# EAGLE design logic_board (EAGLE 9.1.3)
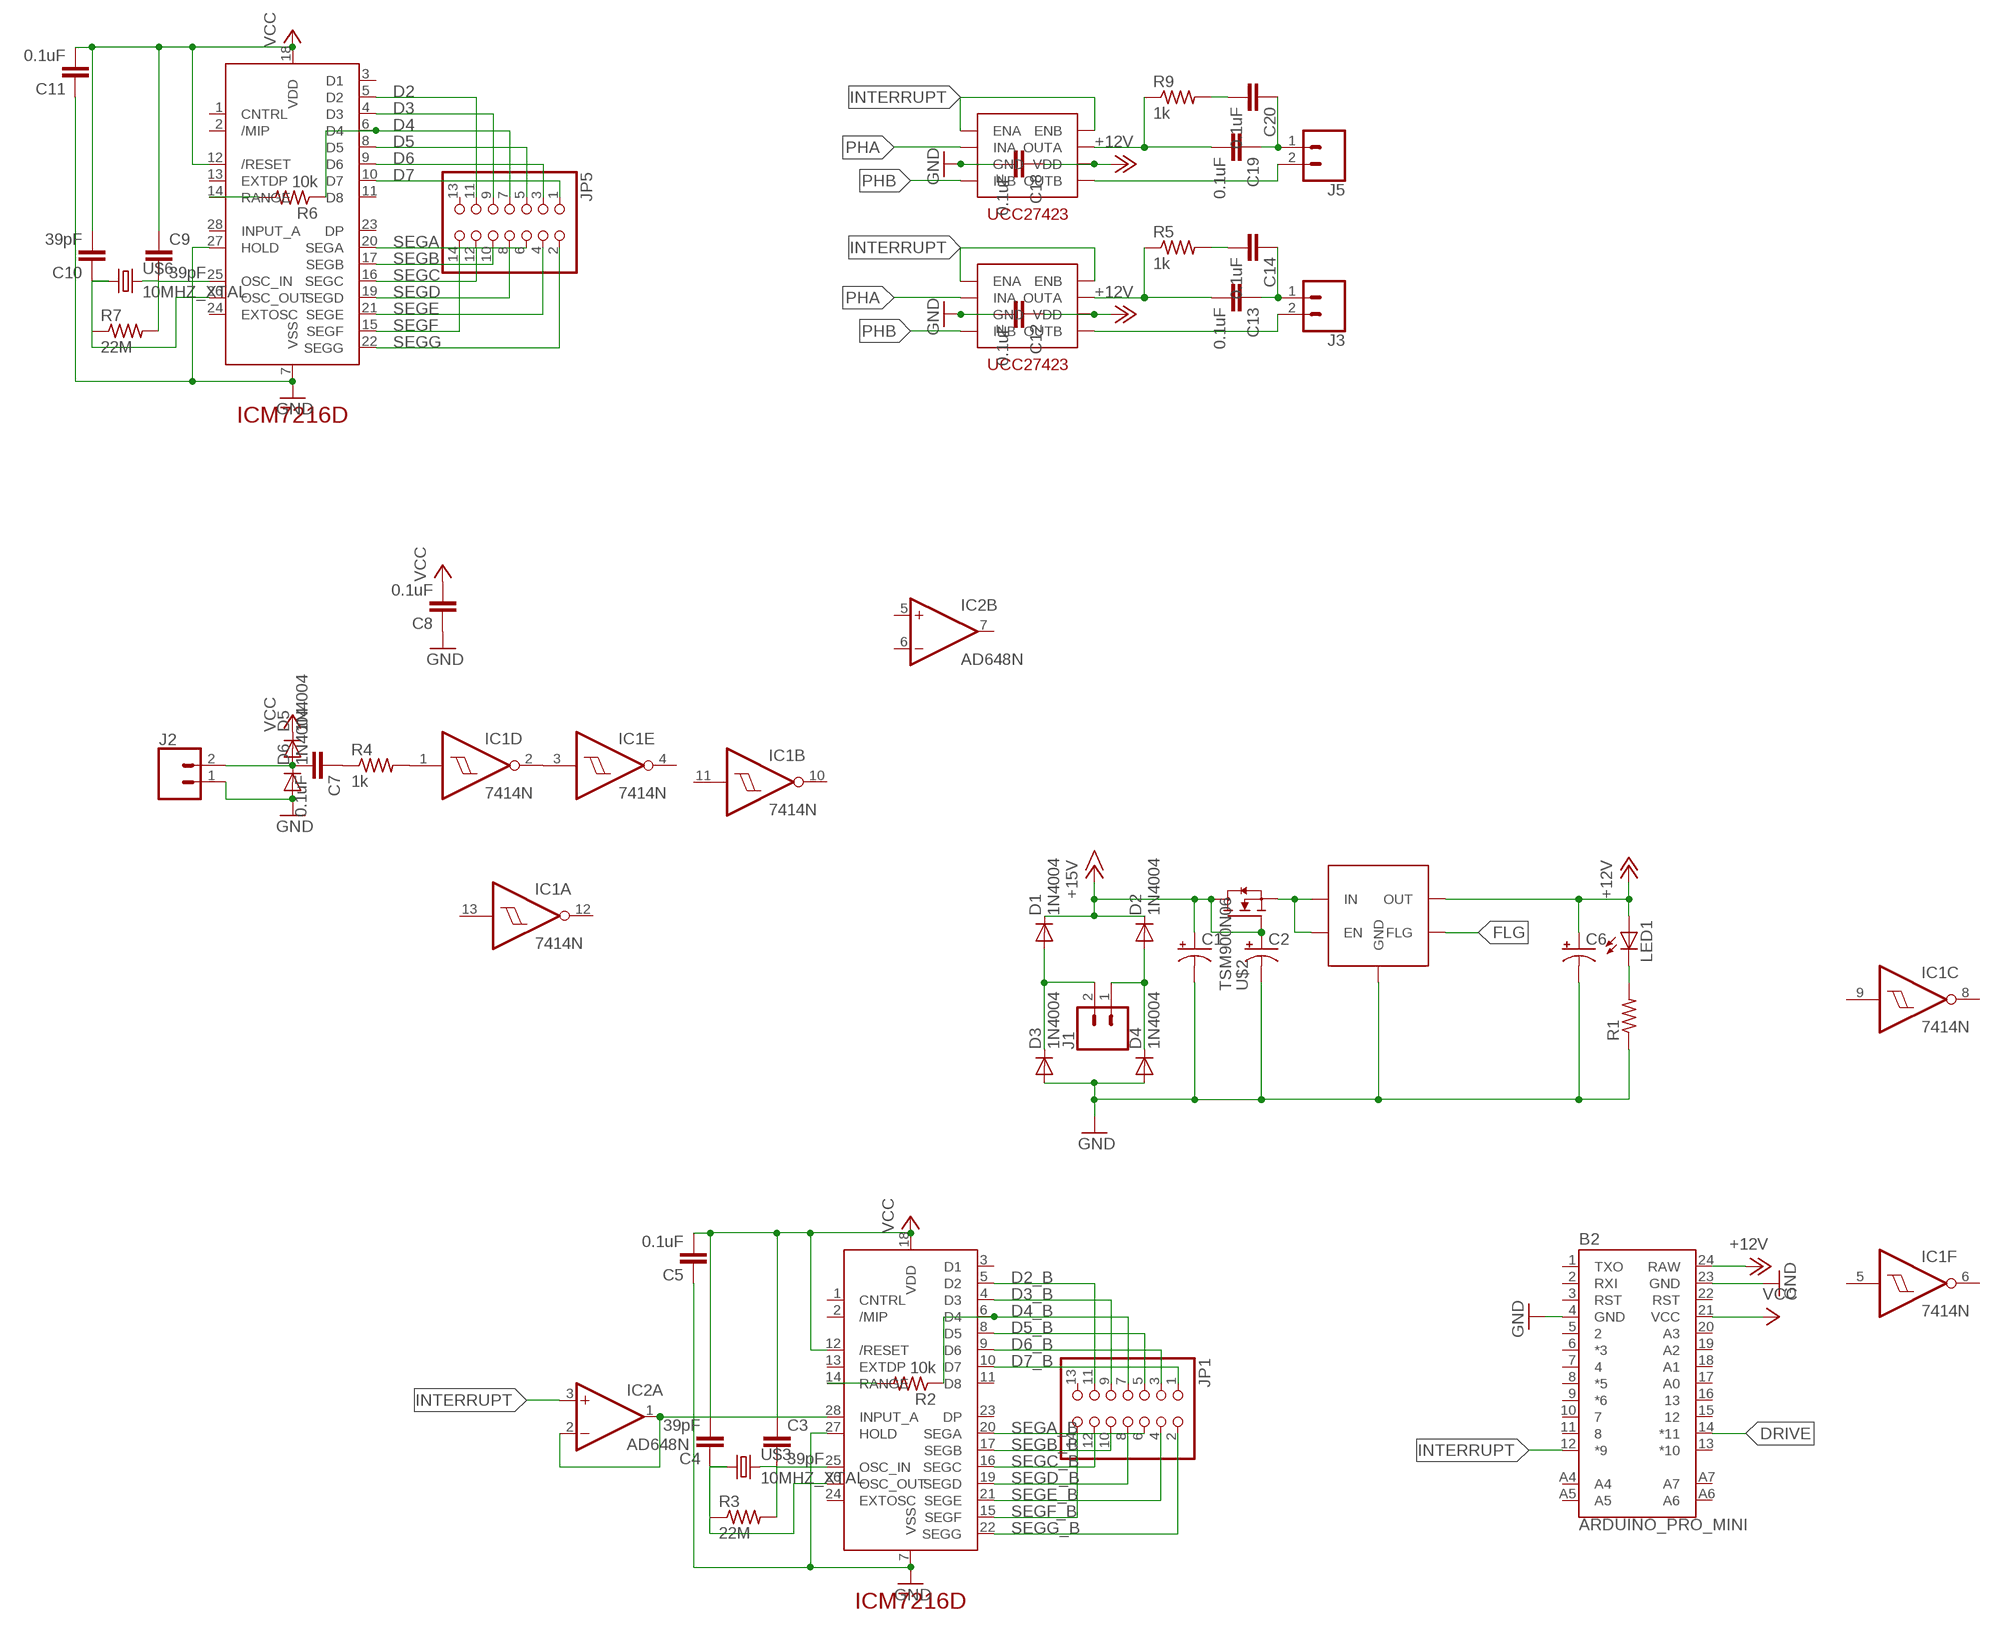
[diagram p0: schematic, sheet 1]

## Parts
B2  ARDUINO_PRO_MINI  [ARDUINO_PRO_MINI]
C1  CPOL-USE7.5-16  [E7,5-16]
C2  CPOL-USE7.5-16  [E7,5-16]
C3  39pF  C-EU050-030X075  [C050-030X075]
C4  39pF  C-EU050-030X075  [C050-030X075]
C5  0.1uF  C-EU050-030X075  [C050-030X075]
C6  CPOL-USE7.5-16  [E7,5-16]
C7  0.1uF  C-EU050-030X075  [C050-030X075]
C8  0.1uF  C-EU050-030X075  [C050-030X075]
C9  39pF  C-EU050-030X075  [C050-030X075]
C10  39pF  C-EU050-030X075  [C050-030X075]
C11  0.1uF  C-EU050-030X075  [C050-030X075]
C12  0.1uF  C-EU050-030X075  [C050-030X075]
C13  0.1uF  C-EU050-030X075  [C050-030X075]
C14  0.1uF  C-EU050-030X075  [C050-030X075]
C18  0.1uF  C-EU050-030X075  [C050-030X075]
C19  0.1uF  C-EU050-030X075  [C050-030X075]
C20  0.1uF  C-EU050-030X075  [C050-030X075]
D1  1N4004  [DO41-10]
D2  1N4004  [DO41-10]
D3  1N4004  [DO41-10]
D4  1N4004  [DO41-10]
D5  1N4004  [DO41-10]
D6  1N4004  [DO41-10]
IC1  7414N  [DIL14]
IC2  AD648N  [DIL08]
J1  CONN_025MM  [SCREWTERMINAL-5MM-2]
J2  CONN_025MM  [SCREWTERMINAL-5MM-2]
J3  CONN_025MM  [SCREWTERMINAL-5MM-2]
J5  CONN_025MM  [SCREWTERMINAL-5MM-2]
JP1  PINHD-2X7  [2X07]
JP5  PINHD-2X7  [2X07]
LED1  LED5MM  [LED5MM]
R1  R-US_0204/7  [0204/7]
R2  10k  R-US_0204/7  [0204/7]
R3  22M  R-US_0204/7  [0204/7]
R4  1k  R-US_0204/7  [0204/7]
R5  1k  R-US_0204/7  [0204/7]
R6  10k  R-US_0204/7  [0204/7]
R7  22M  R-US_0204/7  [0204/7]
R9  1k  R-US_0204/7  [0204/7]
U$1  ICM7216D  [DIP1524W55P254L3740H635Q28B]
U$2  TSM900N06  [TO-251S]
U$3  10MHZ_XTAL  [XTAL]
U$4  MIC29301  [TO-220]
U$5  ICM7216D  [DIP1524W55P254L3740H635Q28B]
U$6  10MHZ_XTAL  [XTAL]
U$7  UCC27423  [DIP762W53P254L959H508Q8B]
U$9  UCC27423  [DIP762W53P254L959H508Q8B]

## Nets
+12V: B2.24(RAW) C6.+ C12.1 C18.1 LED1.A U$4.P$4(OUT) U$7.6(VDD) U$9.6(VDD)
+15V: C1.+ C2.+ D1.C D2.C U$2.P$1(G) U$2.P$2(D)
D2: JP5.11 U$5.5(D2)
D2_B: JP1.11 U$1.5(D2)
D3: JP5.9 U$5.4(D3)
D3_B: JP1.9 U$1.4(D3)
D4: JP5.7 R6.1 U$5.6(D4)
D4_B: JP1.7 R2.1 U$1.6(D4)
D5: JP5.5 U$5.8(D5)
D5_B: JP1.5 U$1.8(D5)
D6: JP5.3 U$5.9(D6)
D6_B: JP1.3 U$1.9(D6)
D7: JP5.1 U$5.10(D7)
D7_B: JP1.1 U$1.10(D7)
DRIVE: B2.14(*11)
FLG: U$4.P$5(FLG)
GND: B2.4(GND) B2.23(GND) C1.- C2.- C5.1 C6.- C8.1 C11.1 C12.2 C18.2 D3.A D4.A D6.A J2.1 R1.1 U$1.7(VSS) U$1.27(HOLD) U$4.P$3(GND) U$5.7(VSS) U$5.27(HOLD) U$7.3(GND) U$9.3(GND)
INTERRUPT: B2.12(*9) IC2.3(A:+IN) U$7.1(ENA) U$7.8(ENB) U$9.1(ENA) U$9.8(ENB)
N$1: D1.A D3.C J1.2
N$2: D2.A D4.C J1.1
N$3: U$2.P$3(S) U$4.P$1(EN) U$4.P$2(IN)
N$5: LED1.K(C) R1.2
N$6: C3.2 R3.2 U$1.25(OSC_IN) U$3.P$2
N$7: C4.1 R3.1 U$1.26(OSC_OUT) U$3.P$1
N$8: C7.2 D5.A D6.C J2.2
N$9: C13.1 C14.1 J3.1
N$10: C7.1 R4.1
N$11: R2.2 U$1.14(RANGE)
N$12: R6.2 U$5.14(RANGE)
N$13: C9.2 R7.2 U$5.25(OSC_IN) U$6.P$2
N$14: C10.1 R7.1 U$5.26(OSC_OUT) U$6.P$1
N$15: IC1.1(D:I) R4.2
N$16: IC1.2(D:O) IC1.3(E:I)
N$17: C14.2 R5.2
N$18: C13.2 R5.1 U$7.7(OUTA)
N$19: J3.2 U$7.5(OUTB)
N$20: IC2.1(A:OUT) IC2.2(A:-IN) U$1.28(INPUT_A)
N$24: C19.1 C20.1 J5.1
N$25: C20.2 R9.2
N$26: C19.2 R9.1 U$9.7(OUTA)
N$27: J5.2 U$9.5(OUTB)
PHA: U$7.2(INA) U$9.2(INA)
PHB: U$7.4(INB) U$9.4(INB)
SEGA: JP5.6 U$5.20(SEGA)
SEGA_B: JP1.6 U$1.20(SEGA)
SEGB: JP5.10 U$5.17(SEGB)
SEGB_B: JP1.10 U$1.17(SEGB)
SEGC: JP5.12 U$5.16(SEGC)
SEGC_B: JP1.12 U$1.16(SEGC)
SEGD: JP5.8 U$5.19(SEGD)
SEGD_B: JP1.8 U$1.19(SEGD)
SEGE: JP5.4 U$5.21(SEGE)
SEGE_B: JP1.4 U$1.21(SEGE)
SEGF: JP5.14 U$5.15(SEGF)
SEGF_B: JP1.14 U$1.15(SEGF)
SEGG: JP5.2 U$5.22(SEGG)
SEGG_B: JP1.2 U$1.22(SEGG)
VCC: B2.21(VCC) C3.1 C4.2 C5.2 C8.2 C9.1 C10.2 C11.2 D5.C U$1.12(/RESET) U$1.18(VDD) U$5.12(/RESET) U$5.18(VDD)
Unconnected: B2.1(TXO) B2.2(RXI) B2.3(RST) B2.5 B2.6(*3) B2.7 B2.8(*5) B2.9(*6) B2.10 B2.11 B2.13(*10) B2.15 B2.16 B2.17(A0) B2.18(A1) B2.19(A2) B2.20(A3) B2.22(RST) B2.A4 B2.A5 B2.A6 B2.A7 IC1.4(E:O) IC1.5(F:I) IC1.6(F:O) IC1.8(C:O) IC1.9(C:I) IC1.10(B:O) IC1.11(B:I) IC1.12(A:O) IC1.13(A:I) IC2.5(B:+IN) IC2.6(B:-IN) IC2.7(B:OUT) JP1.13 JP5.13 U$1.1(CNTRL) U$1.2(/MIP) U$1.3(D1) U$1.11(D8) U$1.13(EXTDP) U$1.23(DP) U$1.24(EXTOSC) U$5.1(CNTRL) U$5.2(/MIP) U$5.3(D1) U$5.11(D8) U$5.13(EXTDP) U$5.23(DP) U$5.24(EXTOSC) U$5.28(INPUT_A)

## Power pins joined to a net without a drawn wire
GND: IC1.7(P:GND)
V+: IC2.8(P:V+)
V-: IC2.4(P:V-)
VCC: IC1.14(P:VCC)

## Library data of the parts
B2 = SparkFun-Boards:ARDUINO_PRO_MINI: SparkFun Pro Mini Pro Mini compatible footprint. Dimensions: 0.7 x 1.3" PCB Thickness: 0.8mm SparkFun Products: 3.3V/8MHz <https://www.sparkfun.com/products/11114> 5V/16MHz <https://www.sparkfun.com/products/11113>
C1 C2 C6 = resistor:CPOL-US: POLARIZED CAPACITOR, American symbol
C3-C5 C7-C14 C18-C20 = resistor:C-EU: CAPACITOR, European symbol
D1-D6 = diode:1N4004: DIODE general purpose rectifier, 1 A
IC1 = 74xx-eu:74*14: Hex schmitt trigger INVERTER
IC2 = linear:AD648: OP AMP
J1-J3 J5 = SparkFun-Connectors:CONN_02: Multi connection point. Often used as Generic Header-pin footprint for 0.1 inch spaced/style header connections On any of the 0.1 inch spaced packages, you can populate with these: Break Away Headers - Straight <https://www.sparkfun.com/products/116> (PRT-00116) Break Away Male Headers - Right Angle <https://www.sparkfun.com/products/553> (PRT-00553) Female Headers <https://www.sparkfun.com/products/115> (PRT-00115) Break Away Headers - Machine Pin <https://www.sparkfun.com/products/117> (PRT-00117) Break Away Female Headers - Swiss Machine Pin <https://www.sparkfun.com/products/743> (PRT-00743) For SCREWTERMINALS and SPRING TERMINALS visit here: Screw Terimnals on SparkFun.com <https://www.sparkfun.com/search/results?term=Screw+Terminals> (5mm/3.5mm/2.54mm spacing) This device is also useful as a general connection point to wire up your design to another part of your project. Our various solder wires solder well into these plated through hole pads. Hook-Up Wire - Assortment (Stranded, 22 AWG) <https://www.sparkfun.com/products/11375> (PRT-11375) Hook-Up Wire - Assortment (Solid Core, 22 AWG) <https://www.sparkfun.com/products/11367> (PRT-11367) View the entire wire category on our website here <https://www.sparkfun.com/categories/141> Special notes: Molex polarized connector foot print use with: PRT-08233 with associated crimp pins and housings. 2.54_SCREWTERM for use with PRT-10571. 3.5mm Screw Terminal footprints for PRT-08084 5mm Screw Terminal footprints for use with PRT-08432; SF_SKU: PRT-08432
JP1 JP5 = pinhead:PINHD-2X7: PIN HEADER
LED1 = led:LED: LED OSRAM: - CHIPLED LG R971, LG N971, LY N971, LG Q971, LY Q971, LO R971, LY R971 LH N974, LH R974 LS Q976, LO Q976, LY Q976 LO Q996 - Hyper CHIPLED LW Q18S LB Q993, LB Q99A, LB R99A - SideLED LS A670, LO A670, LY A670, LG A670, LP A670 LB A673, LV A673, LT A673, LW A673 LH A674 LY A675 LS A676, LA A676, LO A676, LY A676, LW A676 LS A679, LY A679, LG A679 - Hyper Micro SIDELED® LS Y876, LA Y876, LO Y876, LY Y876 LT Y87S - SmartLED LW L88C, LW L88S LB L89C, LB L89S, LG L890 LS L89K, LO L89K, LY L89K LS L896, LA L896, LO L896, LY L896 - TOPLED LS T670, LO T670, LY T670, LG T670, LP T670 LSG T670, LSP T670, LSY T670, LOP T670, LYG T670 LG T671, LOG T671, LSG T671 LB T673, LV T673, LT T673, LW T673 LH T674 LS T676, LA T676, LO T676, LY T676, LB T676, LH T676, LSB T676, LW T676 LB T67C, LV T67C, LT T67C, LS T67K, LO T67K, LY T67K, LW E67C LS E67B, LA E67B, LO E67B, LY E67B, LB E67C, LV E67C, LT E67C LW T67C LS T679, LY T679, LG T679 LS T770, LO T770, LY T770, LG T770, LP T770 LB T773, LV T773, LT T773, LW T773 LH T774 LS E675, LA E675, LY E675, LS T675 LS T776, LA T776, LO T776, LY T776, LB T776 LHGB T686 LT T68C, LB T68C - Hyper Mini TOPLED® LB M676 - Mini TOPLED Santana® LG M470 LS M47K, LO M47K, LY M47K Source: http://www.osram.convergy.de LUXEON: - LUMILED® LXK2-PW12-R00, LXK2-PW12-S00, LXK2-PW14-U00, LXK2-PW14-V00 LXK2-PM12-R00, LXK2-PM12-S00, LXK2-PM14-U00 LXK2-PE12-Q00, LXK2-PE12-R00, LXK2-PE12-S00, LXK2-PE14-T00, LXK2-PE14-U00 LXK2-PB12-K00, LXK2-PB12-L00, LXK2-PB12-M00, LXK2-PB14-N00, LXK2-PB14-P00, LXK2-PB14-Q00 LXK2-PR12-L00, LXK2-PR12-M00, LXK2-PR14-Q00, LXK2-PR14-R00 LXK2-PD12-Q00, LXK2-PD12-R00, LXK2-PD12-S00 LXK2-PH12-R00, LXK2-PH12-S00 LXK2-PL12-P00, LXK2-PL12-Q00, LXK2-PL12-R00 Source: www.luxeon.com KINGBRIGHT: KA-3528ASYC Source: www.kingbright.com
R1-R7 R9 = resistor:R-US_: RESISTOR, American symbol
U$1 U$5 = teslacoil:ICM7216D
U$2 = teslacoil:TSM900N06
U$3 U$6 = teslacoil:10MHZ_XTAL
U$4 = teslacoil:MIC29301
U$7 U$9 = teslacoil:UCC27423

## Board
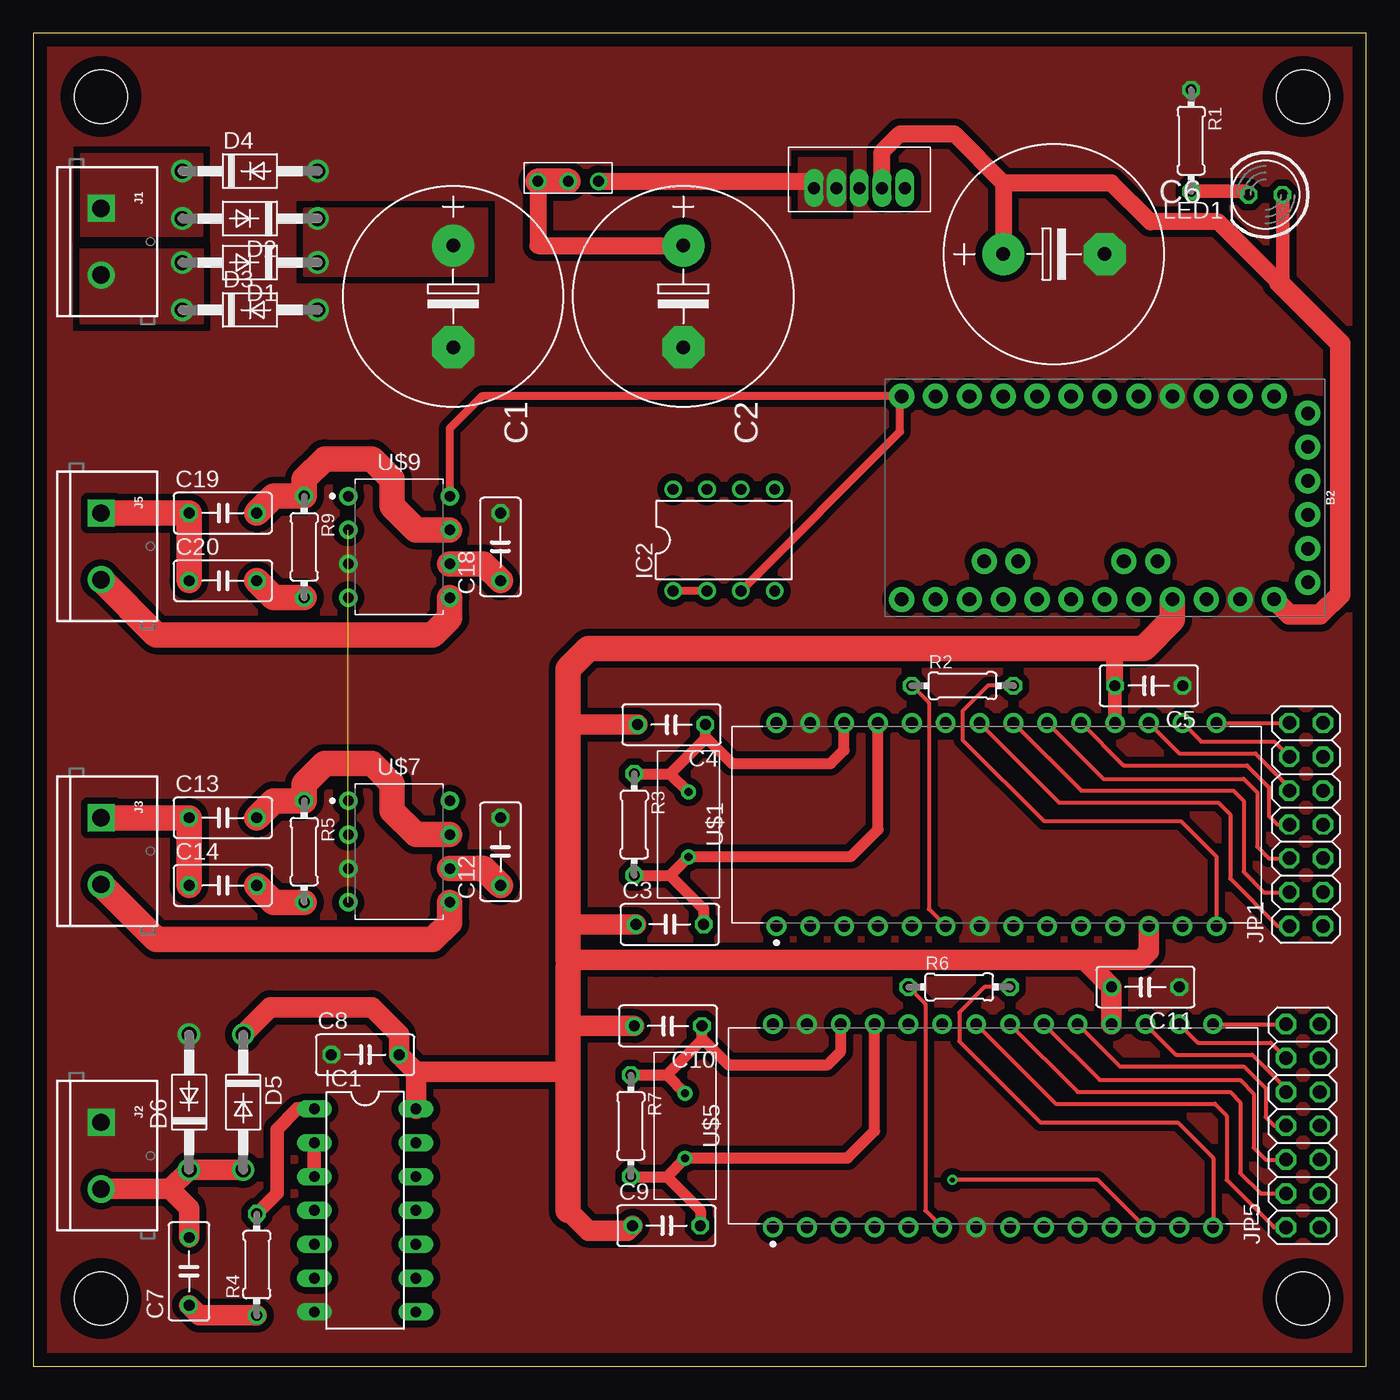
[diagram p1: board, top side]
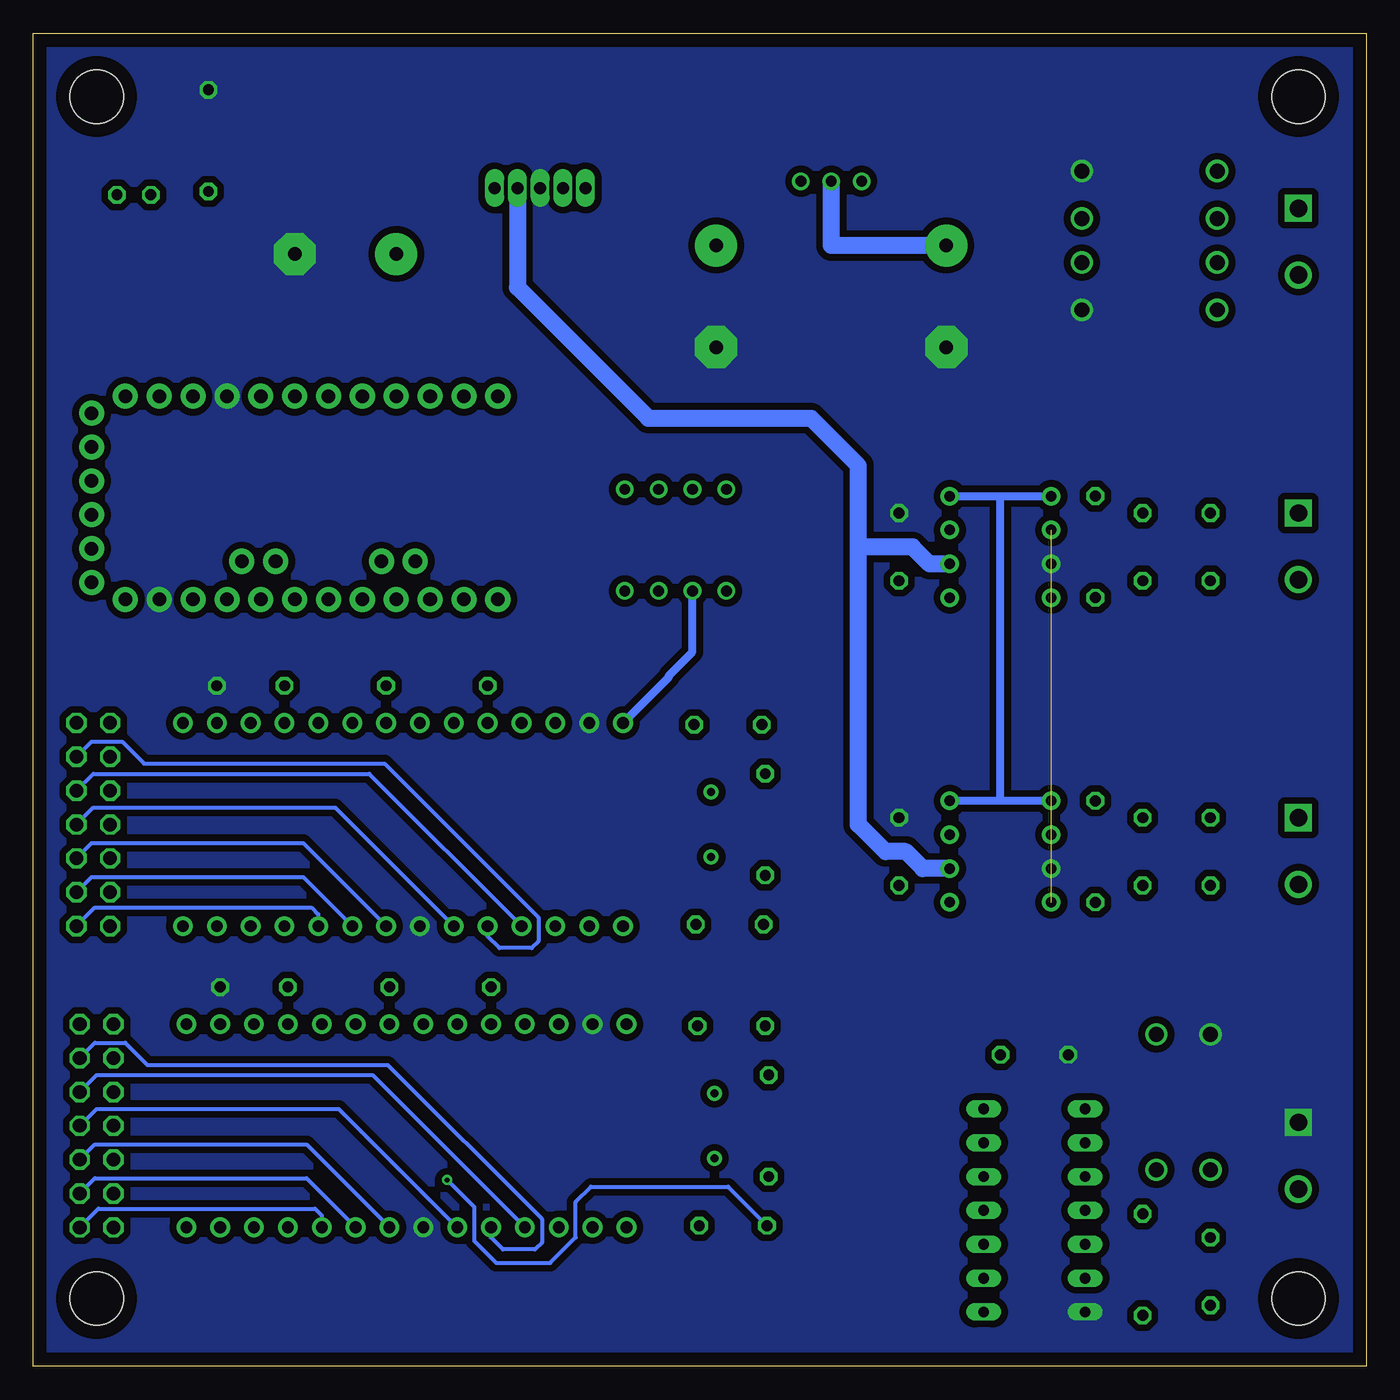
[diagram p2: board, bottom side, seen from below]

Size 100 x 100 mm. Coordinates in mm from the lower left corner, seen from the top.
Outline: 0,0 100,0 100,100 0,100 0,0
Copper layers (1*16): Top 0.035mm / dielectric 1.5mm / Bottom 0.035mm
Design rules "default": minimum track width 6mil, minimum drill 0.35mm, track to track 6mil, track to pad 6mil, pad to pad 6mil, via to via 6mil, smd to smd 6mil, copper to edge 40mil, drill to drill 6mil, minimum pad ring 10mil, minimum via ring 8mil, stop-mask expansion 4mil, vias tented up to drill 0mil, thermal gap 10mil
Holes 4 mm at 5.08,5.08 95.25,5.08 95.25,95.25 5.08,95.25

### Footprints (pad centres in the part's own frame; a part is rotated, then mirrored left to right if it is on the bottom)
ARDUINO_PRO_MINI = drill 1.016 pad 1.88: 1 -7.62,12.7; 2 -7.62,10.16; 3 -7.62,7.62; 4 -7.62,5.08; 5 -7.62,2.54; 6 -7.62,0; 7 -7.62,-2.54; 8 -7.62,-5.08; 9 -7.62,-7.62; 10 -7.62,-10.16; 11 -7.62,-12.7; 12 -7.62,-15.24; 13 7.62,-15.24; 14 7.62,-12.7; 15 7.62,-10.16; 16 7.62,-7.62; 17 7.62,-5.08; 18 7.62,-2.54; 19 7.62,0; 20 7.62,2.54; 21 7.62,5.08; 22 7.62,7.62; 23 7.62,10.16; 24 7.62,12.7; A4 4.763,1.429; A5 4.763,3.969; A6 4.763,-9.049; A7 4.763,-6.509; BLK -6.35,15.24; GND -3.81,15.24; GRN 6.35,15.24; RXI 1.27,15.24; TXO 3.81,15.24; VCC -1.27,15.24
E7,5-16 = drill 1.016 pad 3.15: + -3.81,0 | drill 1.016 pad 3.15 octagon: - 3.81,0
C050-030X075 = drill 0.813 octagon: 1 -2.54,0; 2 2.54,0
DO41-10 = drill 1.118: A 5.08,0; C -5.08,0
DIL14 = drill 0.813 long: 1 -7.62,-3.81; 2 -5.08,-3.81; 3 -2.54,-3.81; 4 0,-3.81; 5 2.54,-3.81; 6 5.08,-3.81; 7 7.62,-3.81; 8 7.62,3.81; 9 5.08,3.81; 10 2.54,3.81; 11 0,3.81; 12 -2.54,3.81; 13 -5.08,3.81; 14 -7.62,3.81
DIL08 = drill 0.813 pad 1.27: 1 -3.81,-3.81; 2 -1.27,-3.81; 3 1.27,-3.81; 4 3.81,-3.81; 5 3.81,3.81; 6 1.27,3.81; 7 -1.27,3.81; 8 -3.81,3.81
SCREWTERMINAL-5MM-2 = drill 1.3 pad 2.032 square: 1 0,0 | drill 1.3 pad 2.032: 2 5,0
2X07 = drill 1.016 octagon: 1 -7.62,-1.27; 2 -7.62,1.27; 3 -5.08,-1.27; 4 -5.08,1.27; 5 -2.54,-1.27; 6 -2.54,1.27; 7 0,-1.27; 8 0,1.27; 9 2.54,-1.27; 10 2.54,1.27; 11 5.08,-1.27; 12 5.08,1.27; 13 7.62,-1.27; 14 7.62,1.27
LED5MM = drill 0.813 octagon: A -1.27,0; K 1.27,0
0204/7 = drill 0.813 octagon: 1 -3.81,0; 2 3.81,0
DIP1524W55P254L3740H635Q28B = drill 0.876 pad 1.476: 1 -7.62,16.51; 2 -7.62,13.97; 3 -7.62,11.43; 4 -7.62,8.89; 5 -7.62,6.35; 6 -7.62,3.81; 7 -7.62,1.27; 8 -7.62,-1.27; 9 -7.62,-3.81; 10 -7.62,-6.35; 11 -7.62,-8.89; 12 -7.62,-11.43; 13 -7.62,-13.97; 14 -7.62,-16.51; 15 7.62,-16.51; 16 7.62,-13.97; 17 7.62,-11.43; 18 7.62,-8.89; 19 7.62,-6.35; 20 7.62,-3.81; 21 7.62,-1.27; 22 7.62,1.27; 23 7.62,3.81; 24 7.62,6.35; 25 7.62,8.89; 26 7.62,11.43; 27 7.62,13.97; 28 7.62,16.51
TO-251S = drill 0.8: P$1 -2.28,0; P$2 0,0; P$3 2.28,0
XTAL = drill 0.6: P$1 -2.44,0; P$2 2.44,0
TO-220 = drill 0.9 long: P$1 -3.404,0; P$2 -1.702,0; P$3 0,0; P$4 1.702,0; P$5 3.404,0
DIP762W53P254L959H508Q8B = drill 0.786 pad 1.386: 1 -3.81,3.81; 2 -3.81,1.27; 3 -3.81,-1.27; 4 -3.81,-3.81; 5 3.81,-3.81; 6 3.81,-1.27; 7 3.81,1.27; 8 3.81,3.81

### Placement (x,y rotation side)
B2  80.39,65.15 270 top
C1  31.5,80.26 270 top
C2  48.77,80.26 270 top
C3  47.75,33.15 0 top
C4  47.88,48.13 180 top
C5  83.69,51.05 180 top
C6  76.58,83.44 0 top
C7  11.68,7.11 90 top
C8  24.89,23.37 0 top
C9  47.5,10.54 0 top
C10  47.62,25.53 180 top
C11  83.44,28.45 180 top
C12  35.05,38.61 90 top
C13  14.22,41.15 0 top
C14  14.22,36.07 0 top
C18  35.05,61.47 90 top
C19  14.22,64.01 0 top
C20  14.22,58.93 0 top
D1  16.26,82.8 180 top
D2  16.26,86.11 180 top
D3  16.26,79.25 0 top
D4  16.26,89.66 0 top
D5  15.75,19.81 270 top
D6  11.68,19.81 90 top
IC1  24.89,11.68 270 top
IC2  51.82,61.98 0 top
J1  5.08,86.87 270 top
J2  5.08,18.29 270 top
J3  5.08,41.15 270 top
J5  5.08,64.01 270 top
JP1  95.5,40.64 90 top
JP5  95.25,18.03 90 top
LED1  92.46,87.88 180 top
R1  86.87,91.95 270 top
R2  69.72,51.05 0 top
R3  45.09,40.64 270 top
R4  16.76,7.62 90 top
R5  20.32,38.61 270 top
R6  69.47,28.45 0 top
R7  44.83,18.03 270 top
R9  20.32,61.47 270 top
U$1  72.26,40.64 90 top
U$2  40.13,88.9 0 top
U$3  49.15,40.64 270 top
U$4  61.98,88.39 0 top
U$5  72.01,18.03 90 top
U$6  48.9,18.03 270 top
U$7  27.43,38.61 0 top
U$9  27.43,61.47 0 top

### Tracks (layer width: path | path; a pad name or v marks a point on that pad's centre or on a via)
+12V
  Top 1.016: LED1.A 93.73,81.53 93.47,81.28
  Top 1.27: U$4.P$4 63.68,91.11 65.02,92.46 69.09,92.46 72.77,88.77 | 72.77,88.77 C6.+ | 93.47,81.28 88.9,85.85 83.82,85.85 80.9,88.77 72.77,88.77
  Top 1.524: B2.24 94.23,56.39 96.52,56.39 98.04,57.91 98.04,76.71 93.47,81.28
  Top 1.905: U$7.6 33.78,37.34 C12.1 | U$9.6 33.78,60.2 C18.1
  Bottom 1.27: U$4.P$4 63.68,80.95 53.85,71.12 41.66,71.12 38.1,67.56 38.1,61.47 | U$7.6 33.27,37.34 34.54,38.61 36.07,38.61 38.1,40.64 38.1,61.47 | U$9.6 32.77,60.2 34.04,61.47 38.1,61.47
+15V
  Top 1.27: U$2.P$1 37.85,84.07 C2.+
  Top 1.905: U$2.P$1 U$2.P$2
  Bottom 1.27: C1.+ 40.13,84.07 U$2.P$2
  pour Top (no thermals): 20.32,86.87 34.04,86.87 34.04,81.79 20.32,81.79
D2
  Bottom 0.305: JP5.11 95.38,24.26 93.09,24.26 91.44,22.61 73.41,22.61 61.85,11.05 61.85,9.27 62.36,8.76 64.77,8.76 65.66,9.65 U$5.5
D2_B
  Bottom 0.305: JP1.11 95.63,46.86 93.34,46.86 91.69,45.21 73.66,45.21 62.1,33.66 62.1,31.88 62.61,31.37 65.02,31.37 65.91,32.26 U$1.5
D3
  Bottom 0.305: JP5.9 95.25,21.84 74.55,21.84 U$5.4
D3_B
  Bottom 0.305: JP1.9 95.5,44.45 74.8,44.45 U$1.4
D4
  Top 0.305: R6.1 66.93,27.18 66.93,11.68 U$5.6
  Bottom 0.305: JP5.7 95.25,19.3 77.09,19.3 U$5.6
D4_B
  Top 0.305: R2.1 67.18,49.78 67.18,34.29 U$1.6
  Bottom 0.305: JP1.7 95.5,41.91 77.34,41.91 U$1.6
D5
  Bottom 0.305: JP5.5 95.38,16.64 79.5,16.64 U$5.8
D5_B
  Bottom 0.305: JP1.5 95.63,39.24 79.76,39.24 U$1.8
D6
  Bottom 0.305: JP5.3 95.38,14.1 79.5,14.1 U$5.9
D6_B
  Bottom 0.305: JP1.3 95.63,36.7 79.76,36.7 U$1.9
D7
  Bottom 0.305: JP5.1 95.12,11.81 78.87,11.81 78.36,11.3 U$5.10
D7_B
  Bottom 0.305: JP1.1 95.38,34.42 79.12,34.42 78.61,33.91 U$1.10
GND
  pour Top (isolate 0.508, rank 5, no thermals): 0,0 100,0 100,100 0,100
  pour Bottom (isolate 0.508, rank 4, no thermals): 0,0 100,0 100,100 0,100
INTERRUPT
  Top 0.61: B2.12 65.02,72.77 | 65.02,72.77 33.66,72.77 31.24,70.36 U$9.8 | IC2.3 65.02,70.1 65.02,72.77
  Bottom 0.61: U$9.8 27.43,65.28 | 27.43,65.28 U$9.1 | U$7.8 U$7.1 27.43,42.42 27.43,65.28
N$1
  pour Top (no thermals): 3.56,83.82 12.7,83.82 12.7,78.23 3.56,78.23
N$2
  pour Top (no thermals): 3.56,84.84 12.7,84.84 12.7,90.93 3.56,90.93
N$3
  Top 1.27: U$2.P$3 58.57,88.9 U$4.P$1
  pour Top (no thermals): 57.4,90.68 60.96,90.68 60.96,86.61 57.4,86.61
N$5
  Top 1.016: R1.2 90.93,88.14 LED1.K
N$6
  Top 0.813: R3.2 47.78,36.83 | 47.78,36.83 U$3.P$2 49.18,38.23 61.34,38.23 63.37,40.26 U$1.25 | 47.78,36.83 50.29,34.32 C3.2
N$7
  Top 0.813: R3.1 47.78,44.45 | 47.78,44.45 U$3.P$1 | 47.78,44.45 50.42,47.09 50.42,47.22 | 50.42,47.22 C4.1 | 50.42,47.22 52.42,45.21 59.82,45.21 60.83,46.23 U$1.26
N$8
  Top 1.524: J2.2 10.24,13.29 | 10.24,13.29 D6.C D5.A | 10.24,13.29 11.68,11.84 C7.2
N$9
  Top 1.905: J3.1 C13.1 C14.1
N$10
  Top 1.524: C7.1 12.45,3.81 R4.1
N$11
  Top 0.305: R2.2 71.63,51.05 69.72,49.15 69.72,46.99 75.82,40.89 86.11,40.89 88.77,38.23 U$1.14
N$12
  Top 0.305: R6.2 71.37,28.45 69.47,26.54 69.47,24.38 75.56,18.29 85.85,18.29 88.52,15.62 U$5.14
N$13
  Top 0.813: R7.2 47.52,14.22 | 47.52,14.22 U$6.P$2 48.92,15.62 61.09,15.62 63.12,17.65 U$5.25 | 47.52,14.22 50.04,11.71 C9.2
N$14
  Top 0.813: R7.1 47.52,21.84 | 47.52,21.84 U$6.P$1 | 47.52,21.84 50.16,24.48 50.16,24.61 | 50.16,24.61 C10.1 | 50.16,24.61 52.17,22.61 59.56,22.61 60.58,23.62 U$5.26
N$15
  Top 1.016: R4.2 18.29,12.95 18.29,17.78 19.81,19.3 IC1.1
N$16
  Top 1.016: IC1.2 IC1.3
N$17
  Top 1.905: C14.2 18.03,34.8 R5.2
N$18
  Top 1.905: C13.2 18.03,42.42 R5.1 20.32,43.69 21.84,45.21 25.4,45.21 26.92,43.69 26.92,41.66 28.7,39.88 U$7.7
N$19
  Top 1.905: J3.2 9.22,32 29.97,32 31.24,33.27 U$7.5
N$20
  Top 0.61: IC2.2 IC2.1
  Bottom 0.61: U$1.28 52.32,51.69 52.32,51.82 50.55,53.59 IC2.2
N$24
  Top 1.905: J5.1 C19.1 C20.1
N$25
  Top 1.905: C20.2 18.03,57.66 R9.2
N$26
  Top 1.905: C19.2 18.03,65.28 R9.1 20.32,66.55 21.84,68.07 25.4,68.07 26.92,66.55 26.92,64.52 28.7,62.74 U$9.7
N$27
  Top 1.905: J5.2 9.22,54.86 29.97,54.86 31.24,56.13 U$9.5
PHA  (1 unrouted)
PHB  (1 unrouted)
SEGA
  Top 0.305: U$5.20 80.01,21.46 90.55,21.46 91.57,20.45 91.57,16.38 92.46,15.49 JP5.6
SEGA_B
  Top 0.305: U$1.20 80.26,44.07 90.81,44.07 91.82,43.05 91.82,38.99 92.71,38.1 JP1.6
SEGB
  Top 0.305: U$5.17 85.72,23.37 91.44,23.37 93.98,20.83 JP5.10
SEGB_B
  Top 0.305: U$1.17 85.98,45.97 91.69,45.97 94.23,43.43 JP1.10
SEGC
  Top 0.305: U$5.16 87.38,24.26 92.84,24.26 JP5.12
SEGC_B
  Top 0.305: U$1.16 87.63,46.86 93.09,46.86 JP1.12
SEGD
  Top 0.305: U$5.19 81.53,22.48 90.81,22.48 92.46,20.83 92.46,18.67 93.09,18.03 JP5.8
SEGD_B
  Top 0.305: U$1.19 81.79,45.09 91.06,45.09 92.71,43.43 92.71,41.27 93.34,40.64 JP1.8
SEGE
  Top 0.305: U$5.21 78.36,20.57 89.79,20.57 90.55,19.81 90.55,14.48 92.08,12.95 JP5.4
SEGE_B
  Top 0.305: U$1.21 78.61,43.18 90.04,43.18 90.81,42.42 90.81,37.08 92.33,35.56 JP1.4
SEGF
  Top 0.305: U$5.15 JP5.14
SEGF_B
  Top 0.305: U$1.15 JP1.14
SEGG
  Top 0.305: U$5.22 76.71,19.68 88.65,19.68 89.53,18.8 89.53,13.97 93.09,10.41 JP5.2
SEGG_B
  Top 0.305: U$1.22 76.96,42.29 88.9,42.29 89.79,41.4 89.79,36.58 93.34,33.02 JP1.2
VCC  (via drill 0.35)
  Top 0.305: U$5.12 79.88,13.97 v68.96,13.97
  Top 1.016: U$1.18 C5.2
  Top 1.27: C5.2 81.15,53.72 81.28,53.85
  Top 1.524: U$5.18 C11.2 79.38,29.97 78.87,30.48 | 78.87,30.48 46.74,30.48 40.13,30.48 40.13,29.97 | 78.87,30.48 83.06,30.48 83.69,31.11 U$1.12 | D5.C 17.78,26.92 25.4,26.92 27.43,24.89 C8.2 28.7,22.1 | 40.13,11.68 41.66,10.16 44.58,10.16 C9.1 | C4.2 40.51,48.13 40.13,47.75 | C3.1 40.26,33.15 40.13,33.02 | C10.2 40.26,25.53 40.13,25.4 | 28.7,22.1 IC1.14 | 28.7,22.1 39.88,22.1 40.13,21.84
  Top 1.905: B2.21 85.47,56.01 83.31,53.85 81.28,53.85 41.66,53.85 40.13,52.32 40.13,47.75 40.13,33.02 40.13,30.48 | 40.13,29.97 40.13,25.4 40.13,21.84 40.13,11.68
  Bottom 0.305: v68.96,13.97 66.93,11.94 66.93,9.4 65.28,7.75 61.21,7.75 59.31,9.65 59.31,12.32 58.17,13.46 47.88,13.46 C9.1